# Altium schematic sheet QCopterRC_IMU_Sch.SchDoc
size A4
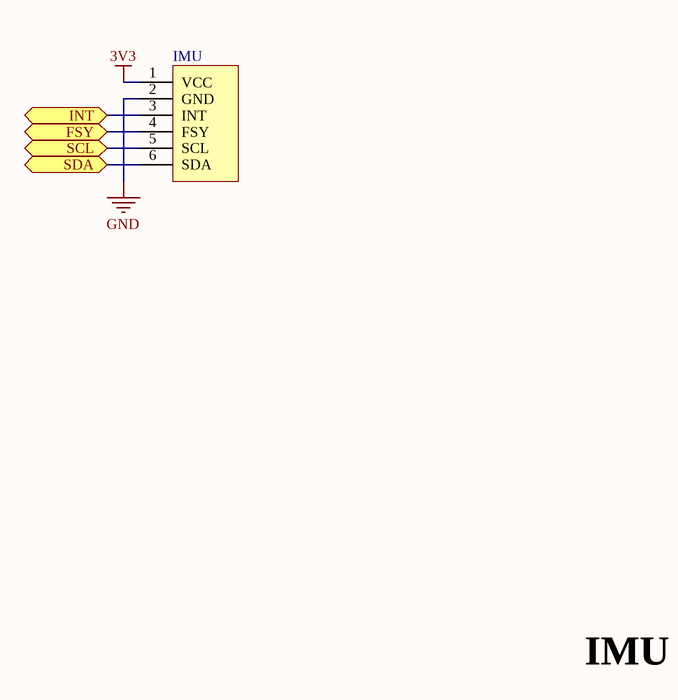
[diagram p0: QCopterRC_IMU_Sch.SchDoc]

## Parts
IMU  IMU_10-DOF  [IMU 10-DOF v1.1]  (value not drawn)

## Ports
FSY, INT, SCL, SDA

## Nets
3V3: IMU.1(VCC)
GND: IMU.2(GND)
FSY: IMU.4(FSY) ; port FSY
INT: IMU.3(INT) ; port INT
SCL: IMU.5(SCL) ; port SCL
SDA: IMU.6(SDA) ; port SDA

## Notes on the sheet
- IMU

## Library data of the parts
IMU = IMU 10 DOF: Module